# Altium schematic sheet HDMI.SchDoc
size A4
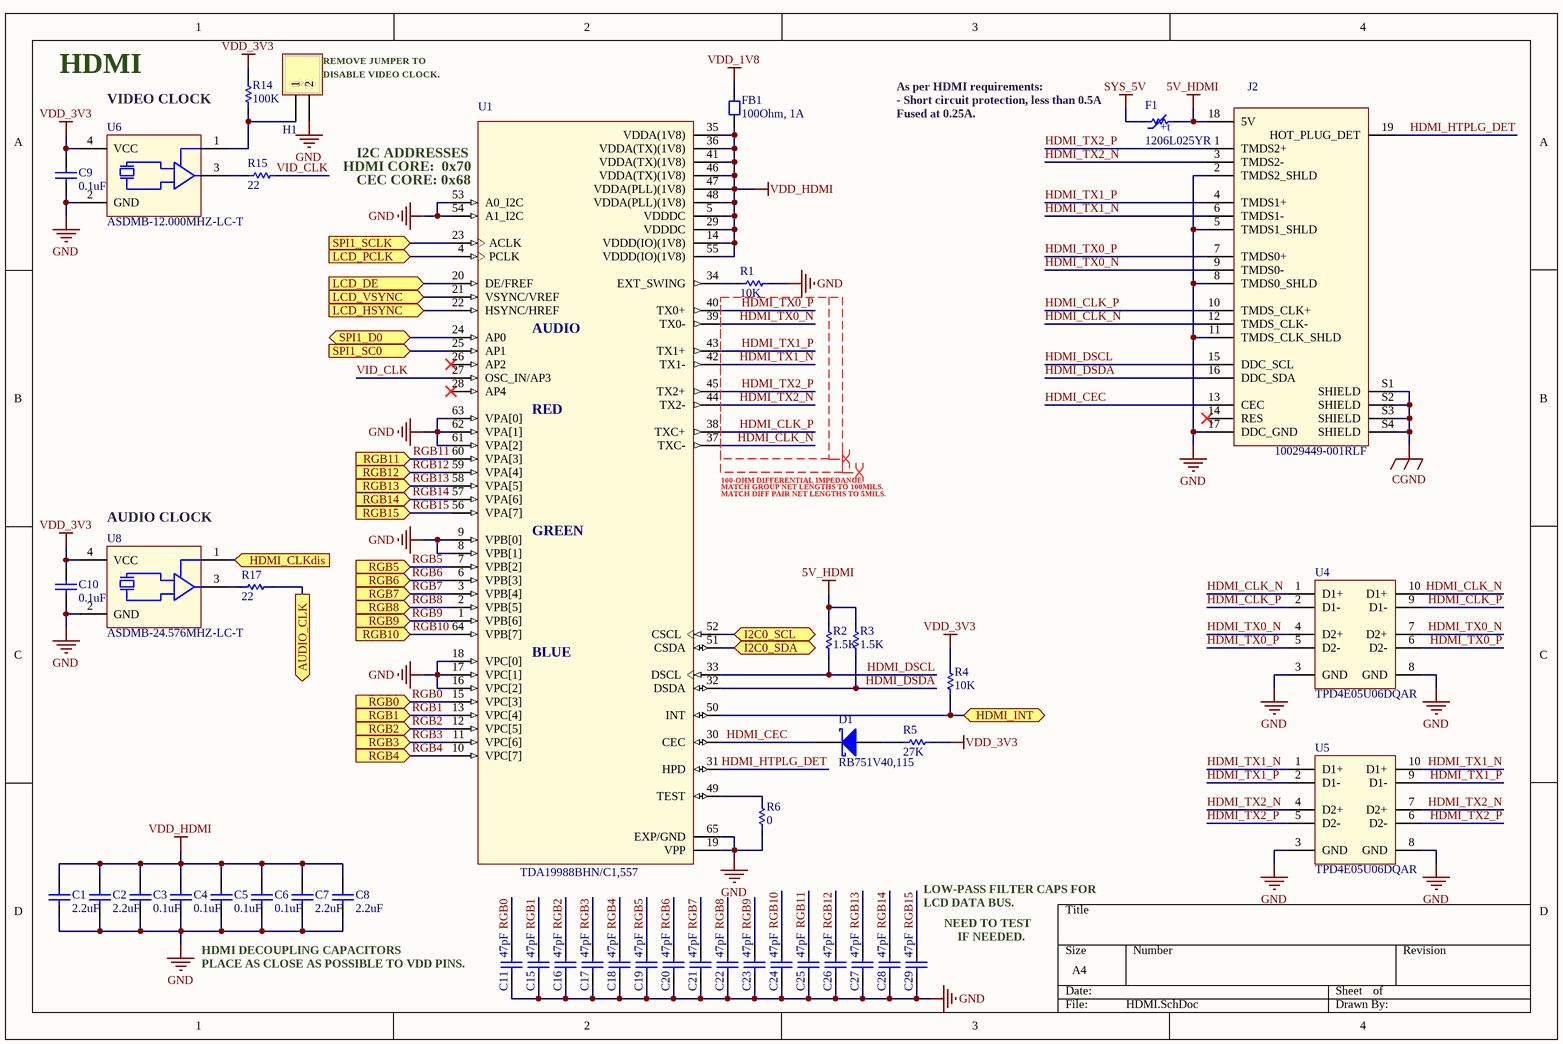
[diagram p0: HDMI.SchDoc]

## Parts
C1  2.2uF  [CAP_0603]
C2  2.2uF  [CAP_0603]
C3  0.1uF  [CAP_0603]
C4  0.1uF  [CAP_0603]
C5  0.1uF  [CAP_0603]
C6  0.1uF  [CAP_0603]
C7  2.2uF  [CAP_0603]
C8  2.2uF  [CAP_0603]
C9  0.1uF  [CAP_0603]
C10  0.1uF  [CAP_0603]
C11  47pF  [CAP_0402]
C15  47pF  [CAP_0402]
C16  47pF  [CAP_0402]
C17  47pF  [CAP_0402]
C18  47pF  [CAP_0402]
C19  47pF  [CAP_0402]
C20  47pF  [CAP_0402]
C21  47pF  [CAP_0402]
C22  47pF  [CAP_0402]
C23  47pF  [CAP_0402]
C24  47pF  [CAP_0402]
C25  47pF  [CAP_0402]
C26  47pF  [CAP_0402]
C27  47pF  [CAP_0402]
C28  47pF  [CAP_0402]
C29  47pF  [CAP_0402]
D1  RB751V40,115  [SOD-323]
F1  1206L025YR  [RES_1206]
FB1  100Ohm, 1A  [CAP_0603]
H1  02p  [HEADER_2X1_2.54MM]  (value not drawn)
J2  10029449-001RLF  [10029449-001RLF]
R1  10K  [RES_0603]
R2  1.5K  [RES_0603]
R3  1.5K  [RES_0603]
R4  10K  [RES_0603]
R5  27K  [RES_0603]
R6  0  [RES_0603]
R14  100K  [RES_0603]
R15  22  [RES_0603]
R17  22  [RES_0603]
U1  TDA19988BHN/C1,557  [HVQFN-64_9x9MM]
U4  TPD4E05U06DQAR  [USON-10_2.5X1MM]
U5  TPD4E05U06DQAR  [USON-10_2.5X1MM]
U6  ASDMB-12.000MHZ-LC-T  [ABRACON_4SMD_QFN]
U8  ASDMB-24.576MHZ-LC-T  [ABRACON_4SMD_QFN]

## Ports
AUDIO_CLK (out), HDMI_CLKdis (in), HDMI_INT (bidir), I2C0_SCL (bidir), I2C0_SDA (bidir), LCD_DE (in), LCD_HSYNC (in), LCD_PCLK (in), LCD_VSYNC (in), RGB0 (in), RGB1 (in), RGB2 (in), RGB3 (in), RGB4 (in), RGB5 (in), RGB6 (in), RGB7 (in), RGB8 (in), RGB9 (in), RGB10 (in), RGB11 (in), RGB12 (in), RGB13 (in), RGB14 (in), RGB15 (in), SPI1_D0 (bidir), SPI1_SC0 (in), SPI1_SCLK (in)

## Nets
5V_HDMI: F1.2 J2.18(5V) R2.2 R3.2
CGND: J2.S1(SHIELD) J2.S2(SHIELD) J2.S3(SHIELD) J2.S4(SHIELD)
GND: C1.1 C2.1 C3.1 C4.1 C5.1 C6.1 C7.1 C8.1 C9.1 C10.1 C11.1(N) C15.1(N) C16.1(N) C17.1(N) C18.1(N) C19.1(N) C20.1(N) C21.1(N) C22.1(N) C23.1(N) C24.1(N) C25.1(N) C26.1(N) C27.1(N) C28.1(N) C29.1(N) H1.2 J2.2(TMDS2_SHLD) J2.5(TMDS1_SHLD) J2.8(TMDS0_SHLD) J2.11(TMDS_CLK_SHLD) J2.17(DDC_GND) R1.1 R6.1 U1.8(VPB[1]) U1.9(VPB[0]) U1.16(VPC[2]) U1.17(VPC[1]) U1.18(VPC[0]) U1.19(VPP) U1.53(A0_I2C) U1.54(A1_I2C) U1.61(VPA[2]) U1.62(VPA[1]) U1.63(VPA[0]) U1.65(EXP/GND) U4.3(GND) U4.8(GND) U5.3(GND) U5.8(GND) U6.2(GND) U8.2(GND)
SYS_5V: F1.1
VDD_1V8: FB1.2
VDD_3V3: C9.2 C10.2 R4.2 R5.2 R14.2 U6.4(VCC) U8.4(VCC)
VDD_HDMI: C1.2 C2.2 C3.2 C4.2 C5.2 C6.2 C7.2 C8.2 FB1.1 U1.5(VDDDC) U1.14(VDDD(IO)(1V8)) U1.29(VDDDC) U1.35(VDDA(1V8)) U1.36(VDDA(TX)(1V8)) U1.41(VDDA(TX)(1V8)) U1.46(VDDA(TX)(1V8)) U1.47(VDDA(PLL)(1V8)) U1.48(VDDA(PLL)(1V8)) U1.55(VDDD(IO)(1V8))
AUDIO_CLK: R17.2 ; port AUDIO_CLK
HDMI_CEC: D1.2(K) J2.13(CEC) U1.30(CEC)
HDMI_CLK_N: J2.12(TMDS_CLK-) U1.37(TXC-) U4.1(D1+) U4.10(D1+)
HDMI_CLK_P: J2.10(TMDS_CLK+) U1.38(TXC+) U4.2(D1-) U4.9(D1-)
HDMI_CLKdis: U8.1(STDBY) ; port HDMI_CLKdis
HDMI_DSCL: J2.15(DDC_SCL) R2.1 U1.33(DSCL)
HDMI_DSDA: J2.16(DDC_SDA) R3.1 U1.32(DSDA)
HDMI_HTPLG_DET: J2.19(HOT_PLUG_DET) U1.31(HPD)
HDMI_INT: R4.1 U1.50(INT) ; port HDMI_INT
HDMI_TX0_N: J2.9(TMDS0-) U1.39(TX0-) U4.4(D2+) U4.7(D2+)
HDMI_TX0_P: J2.7(TMDS0+) U1.40(TX0+) U4.5(D2-) U4.6(D2-)
HDMI_TX1_N: J2.6(TMDS1-) U1.42(TX1-) U5.1(D1+) U5.10(D1+)
HDMI_TX1_P: J2.4(TMDS1+) U1.43(TX1+) U5.2(D1-) U5.9(D1-)
HDMI_TX2_N: J2.3(TMDS2-) U1.44(TX2-) U5.4(D2+) U5.7(D2+)
HDMI_TX2_P: J2.1(TMDS2+) U1.45(TX2+) U5.5(D2-) U5.6(D2-)
I2C0_SCL: U1.52(CSCL) ; port I2C0_SCL
I2C0_SDA: U1.51(CSDA) ; port I2C0_SDA
LCD_DE: U1.20(DE/FREF) ; port LCD_DE
LCD_HSYNC: U1.22(HSYNC/HREF) ; port LCD_HSYNC
LCD_PCLK: U1.4(PCLK) ; port LCD_PCLK
LCD_VSYNC: U1.21(VSYNC/VREF) ; port LCD_VSYNC
RGB0: C11.2(P) U1.15(VPC[3]) ; port RGB0
RGB1: C15.2(P) U1.13(VPC[4]) ; port RGB1
RGB2: C16.2(P) U1.12(VPC[5]) ; port RGB2
RGB3: C17.2(P) U1.11(VPC[6]) ; port RGB3
RGB4: C18.2(P) U1.10(VPC[7]) ; port RGB4
RGB5: C19.2(P) U1.7(VPB[2]) ; port RGB5
RGB6: C20.2(P) U1.6(VPB[3]) ; port RGB6
RGB7: C21.2(P) U1.3(VPB[4]) ; port RGB7
RGB8: C22.2(P) U1.2(VPB[5]) ; port RGB8
RGB9: C23.2(P) U1.1(VPB[6]) ; port RGB9
RGB10: C24.2(P) U1.64(VPB[7]) ; port RGB10
RGB11: C25.2(P) U1.60(VPA[3]) ; port RGB11
RGB12: C26.2(P) U1.59(VPA[4]) ; port RGB12
RGB13: C27.2(P) U1.58(VPA[5]) ; port RGB13
RGB14: C28.2(P) U1.57(VPA[6]) ; port RGB14
RGB15: C29.2(P) U1.56(VPA[7]) ; port RGB15
SPI1_D0: U1.24(AP0) ; port SPI1_D0
SPI1_SC0: U1.25(AP1) ; port SPI1_SC0
SPI1_SCLK: U1.23(ACLK) ; port SPI1_SCLK
VID_CLK: R15.2 U1.27(OSC_IN/AP3)
NetD1_1: D1.1(A) R5.1
NetH1_1: H1.1 R14.1 U6.1(STDBY)
NetR1_2: R1.2 U1.34(EXT_SWING)
NetR6_2: R6.2 U1.49(TEST)
NetR15_1: R15.1 U6.3(OUT)
NetR17_1: R17.1 U8.3(OUT)

Not connected (* = marked no-connect by the designer): J2 14(RES)*; U1 26(AP2)* 28(AP4)*

## Layout directives
differential pair; differential pair class TMDS; rule Matched Net Lengths [Tolerance = 5mil]: HDMI_CLK_N, HDMI_CLK_P, HDMI_TX0_N, HDMI_TX0_P, HDMI_TX1_N, HDMI_TX1_P, HDMI_TX2_N, HDMI_TX2_P
differential pair; differential pair class Z100_DIFF; rule Matched Net Lengths [Tolerance = 100mil]: HDMI_CLK_N, HDMI_CLK_P, HDMI_TX0_N, HDMI_TX0_P, HDMI_TX1_N, HDMI_TX1_P, HDMI_TX2_N, HDMI_TX2_P

## Notes on the sheet
- HDMI
- VIDEO CLOCK
- (near H1) REMOVE JUMPER TO
- (near H1) DISABLE VIDEO CLOCK.
- As per HDMI requirements:
- (near F1) - Short circuit protection, less than 0.5A
- Fused at 0.25A.
- (near U1) HDMI CORE:  0x70
- (near U1) I2C ADDRESSES
- (near U1) CEC CORE: 0x68
- (near U1) AUDIO
- (near U1) RED
- (near U8) AUDIO CLOCK
- (near U1) 100-OHM DIFFERENTIAL IMPEDANCE
- (near U1) MATCH GROUP NET LENGTHS TO 100MILS.
- (near U1) MATCH DIFF PAIR NET LENGTHS TO 5MILS.
- (near U1) GREEN
- (near U1) BLUE
- LOW-PASS FILTER CAPS FOR
- LCD DATA BUS.
- NEED TO TEST
- HDMI DECOUPLING CAPACITORS
- PLACE AS CLOSE AS POSSIBLE TO VDD PINS.
- (near C29) IF NEEDED.
- (in symbol 1206L025YR) +t

## Library data of the parts
C1 C2 C7 C8 = C0603C225M4PAC7867: CAP CER 2.2UF 16V X5R 0603; Manufacturer: KEMET; Manufacturer Part No.: C0603C104M4RACTU; Tolerance: 20%; ComponentLink1Description: Manufacturer; ComponentLink1URL: http://www.we-online.de; Value: 2.2uF; Rated Voltage: 16V; Ceramic Type: X5R; Supplier Part No.: 399-13136-1-ND; Package Reference: CAP_0603; Package Description: 0603; Mounting Technology: SMD; Datasheet: https://content.kemet.com/datasheets/KEM_C1002_X7R_SMD.pdf; Supplier: Digi-Key; ComponentLink2Description: Datasheet; ComponentLink2URL: https://content.kemet.com/datasheets/KEM_C1002_X7R_SMD.pdf
C3-C6 C9 C10 = C0603C104M4RACTU: CAP CER 0.1UF 16V X7R 0603; Manufacturer: KEMET; Tolerance: 20%; ComponentLink1Description: Manufacturer; ComponentLink1URL: http://www.we-online.de; Value: 0.1uF; Rated Voltage: 16V; Ceramic Type: X7R; Supplier Part No.: 399-1099-1-ND; Package Reference: CAP_0603; Package Description: 0603; Mounting Technology: SMD; Manufacturer Part No.: C0603C104M4RACTU; Datasheet: https://content.kemet.com/datasheets/KEM_C1002_X7R_SMD.pdf; Supplier: Digi-Key; ComponentLink2Description: Datasheet; ComponentLink2URL: https://content.kemet.com/datasheets/KEM_C1002_X7R_SMD.pdf
C11 C15-C29 = 885012005011: CAP CER 47PF 10V C0G/NP0 0402; Manufacturer: Wurth Elektronik; Tolerance: 5%; Rated Voltage: 10 VDC; ComponentLink1Description: Manufacturer; ComponentLink1URL: http://www.we-online.de; ComponentLink2Description: Datasheet; ComponentLink2URL: https://katalog.we-online.com/pbs/datasheet/865080345012.pdf; Mounting Technology: SMD; Value: 47 pF; Manufacturer Part No.: 885012005011; Datasheet: https://katalog.we-online.de/pbs/datasheet/885012005011.pdf; Supplier: Digi-Key; Package Reference: CAP_0402; Supplier Part No.: 732-7429-1-ND; Package Description: 0402
D1 = RB751V40,115: DIODE SCHOTTKY 40V 120MA SOD323; Manufacturer: Nexperia USA Inc.; Forward Voltage: 0.37V; Mounting Technology: SMD; Supplier Part No.: 1727-6301-1-ND; Manufacturer Part No.: RB751V40,115; Package Reference: *; Package Description: *; Forward Current: 120mA; Supplier: Digi-Key
F1 = 1206L025YR: PTC RESET FUSE 16V 250MA 1206; Manufacturer: Littelfuse Inc.; Rated Current: 0.25A; Manufacturer Part No.: 1206L025YR; Supplier: Digi-Key; Mounting Technology: SMD; Supplier Part No.: F2110CT-ND; Package Description: Polymeric PTC Resettable Fuse 16V 250mA Ih Surface Mount 1206 (3216 Metric), Concave; Package Reference: CAP_1206; Datasheet: https://www.littelfuse.com/~/media/electronics/datasheets/resettable_ptcs/littelfuse_ptc_1206l_datasheet.pdf.pdf
FB1 = MPZ1608D101BTA00: FERRITE BEAD 100 OHM 0603 1LN; Manufacturer: TDK Corporation; Datasheet: https://product.tdk.com/info/en/catalog/datasheets/beads_commercial_power_mpz1608_en.pdf; Manufacturer Part No.: MPZ1608D101BTA00; Supplier: Digi-Key; Package Description: 100 Ohms @ 100MHz 1 Power Line Ferrite Bead 0603 (1608 Metric) 1A 150mOhm; Supplier Part No.: 445-2988-1-ND; Package Reference: CAP_0603; Mounting Technology: SMD
H1 = 61300211121: CONN HEADER VERT 2POS 2.54MM; Manufacturer: Wurth Elektronik; ComponentLink1Description: Manufacturer; ComponentLink1URL: http://www.we-online.de; ComponentLink2Description: Datasheet; ComponentLink2URL: http://katalog.we-online.de/em/datasheet/6130xx11121.pdf; Supplier Part No.: 732-5315-ND; Supplier: Digi-Key; Package Reference: HEADER_2X1_2.54MM; Package Description: Header 2-pin 2.54mm 100mils; Mounting Technology: THRU; Manufacturer Part No.: 61300211121; Datasheet: https://www.we-online.de/katalog/datasheet/6130xx11121.pdf
J2 = 10029449-001RLF: CONN RCPT 1.4 HDMI 19POS SMD R/A; Manufacturer: Amphenol ICC (FCI); Supplier: Digi-Key; Manufacturer Part No.: 10029449-001RLF; Supplier Part No.: 609-1010-1-ND; Mounting Technology: THRU; Package Reference: 10029449-001RLF; Package Description: HDMI HDMI™ 1.4 Receptacle Connector 19 Position Surface Mount, Right Angle; Through Hole; Datasheet: https://cdn.amphenol-icc.com/media/wysiwyg/files/documentation/datasheet/inputoutput/io_hdmi_receptacles.pdf
R1 R4 = RC0603FR-0710KL: RES SMD 10K OHM 1% 1/10W 0603; Manufacturer: Yageo; Tolerance: 1%; Manufacturer Part No.: RC0603FR-0710KL; Date: 2020; ComponentLink1Description: Manufacturer Link; ComponentLink1URL: http://www.vishay.com/company/brands/dale/; ComponentLink2Description: Datasheet; ComponentLink2URL: http://www.vishay.com/docs/20035/dcrcwe3.pdf; Supplier: Digikey; Supplier Part No.: 311-10.0KHRCT-ND; Datasheet: https://www.yageo.com/upload/media/product/productsearch/datasheet/rchip/PYu-RC_Group_51_RoHS_L_10.pdf; Package Reference: RES_0603; Package Description: 0603; Mounting Technology: SMD; Value: 10K; Power Rating: 1/10W
R2 R3 = RC0603FR-071K5L: RES SMD 1.5K OHM 1% 1/10W 0603; Manufacturer: Yageo; Tolerance: 1%; Manufacturer Part No.: RC0603FR-071K5L; Date: 2020; ComponentLink1Description: Manufacturer Link; ComponentLink1URL: http://www.vishay.com/company/brands/dale/; ComponentLink2Description: Datasheet; ComponentLink2URL: http://www.vishay.com/docs/20035/dcrcwe3.pdf; Supplier: Digikey; Supplier Part No.: 311-1.50KHRCT-ND; Datasheet: https://www.yageo.com/upload/media/product/productsearch/datasheet/rchip/PYu-RC_Group_51_RoHS_L_10.pdf; Package Reference: RES_0603; Package Description: 0603; Mounting Technology: SMD; Value: 1.5K; Power Rating: 1/10W
R5 = RC0603FR-0727KL: RES SMD 27K OHM 1% 1/10W 0603; Manufacturer: Yageo; Tolerance: 1%; Manufacturer Part No.: RC0603FR-0727KL; Date: 2020; ComponentLink1Description: Manufacturer Link; ComponentLink1URL: http://www.vishay.com/company/brands/dale/; ComponentLink2Description: Datasheet; ComponentLink2URL: http://www.vishay.com/docs/20035/dcrcwe3.pdf; Supplier: Digikey; Supplier Part No.: 311-27.0KHRCT-ND; Datasheet: https://www.yageo.com/upload/media/product/productsearch/datasheet/rchip/PYu-RC_Group_51_RoHS_L_10.pdf; Package Reference: RES_0603; Package Description: 0603; Mounting Technology: SMD; Value: 27K; Power Rating: 1/10W
R6 = RC0603JR-070RL: RES SMD 0 OHM JUMPER 1/10W 0603; Manufacturer: Yageo; Manufacturer Part No.: RC0603JR-070RL; Date: 2020; ComponentLink1Description: Manufacturer Link; ComponentLink1URL: http://www.vishay.com/company/brands/dale/; ComponentLink2Description: Datasheet; ComponentLink2URL: http://www.vishay.com/docs/20035/dcrcwe3.pdf; Supplier: Digikey; Supplier Part No.: 311-0.0GRCT-ND; Datasheet: https://www.yageo.com/upload/media/product/productsearch/datasheet/rchip/PYu-RC_Group_51_RoHS_L_10.pdf; Package Reference: RES_0603; Package Description: 0603; Mounting Technology: SMD; Value: 0; Power Rating: 1/10W
R14 = RC0603FR-07100KL: RES SMD 100K OHM 1% 1/10W 0603; Manufacturer: Yageo; Tolerance: 1%; Manufacturer Part No.: RC0603FR-07100KL; Date: 2020; ComponentLink1Description: Manufacturer Link; ComponentLink1URL: http://www.vishay.com/company/brands/dale/; ComponentLink2Description: Datasheet; ComponentLink2URL: http://www.vishay.com/docs/20035/dcrcwe3.pdf; Supplier: Digikey; Supplier Part No.: 311-100KHRCT-ND; Datasheet: https://www.yageo.com/upload/media/product/productsearch/datasheet/rchip/PYu-RC_Group_51_RoHS_L_10.pdf; Package Reference: RES_0603; Package Description: 0603; Mounting Technology: SMD; Value: 100K; Power Rating: 1/10W
R15 R17 = RC0603JR-0722RL: RES SMD 22 OHM 5% 1/10W 0603; Manufacturer: Yageo; Tolerance: 5%; Manufacturer Part No.: RC0603JR-0722RL; Date: 2020; ComponentLink1Description: Manufacturer Link; ComponentLink1URL: http://www.vishay.com/company/brands/dale/; ComponentLink2Description: Datasheet; ComponentLink2URL: http://www.vishay.com/docs/20035/dcrcwe3.pdf; Supplier: Digikey; Supplier Part No.: 311-22GRCT-ND; Datasheet: https://www.yageo.com/upload/media/product/productsearch/datasheet/rchip/PYu-RC_Group_51_RoHS_L_10.pdf; Package Reference: RES_0603; Package Description: 0603; Mounting Technology: SMD; Power Rating: 1/10W; Value: 22
U1 = TDA19988BHN: IC VIDEO HDMI TRANS 64HVQFN; Manufacturer: NXP USA Inc.; Manufacturer Part No.: TDA19988BHN/C1,557; Supplier: Digi-Key; Package Reference: HVQFN-64_9x9MM; Supplier Part No.: 568-12059-ND; Package Description: Video  IC   64-HVQFN (9x9) Package; Mounting Technology: SMD; ComponentLink1Description: Datasheet; ComponentLink1URL: https://media.digikey.com/pdf/Data%20Sheets/NXP%20PDFs/TDA19988_DS_21_july_2011.pdf
U4 U5 = TPD4E05U06DQAR: TVS DIODE 5.5V 14V 10SON; Manufacturer: Texas Instruments; Supplier: Digi-Key; Manufacturer Part No.: TPD4E05U06DQAR; Supplier Part No.: 296-35765-1-ND; Package Reference: USON-10; Package Description: 14V Clamp 2.5A (8/20µs) Ipp Tvs Diode Surface Mount 10-USON (2.5x1); Mounting Technology: SMD; Datasheet: https://www.ti.com/lit/ds/symlink/tpd4e05u06.pdf
U6 = ASDMB-12.000MHZ-LC-T: MEMS OSC XO 12.0000MHZ LVCMOS; Manufacturer: Abracon LLC; Supplier: Digi-Key; Manufacturer Part No.: ASDMB-12.000MHZ-LC-T; Supplier Part No.: 535-11724-1-ND; Mounting Technology: SMD; Package Reference: ABRACON_4SMD_QFN; Package Description: QFN-4, ABRACON 4-SMD; Datasheet: https://abracon.com/Oscillators/ASDMB.pdf
U8 = ASDMB-24.576MHZ-LC-T: MEMS OSC XO 24.5760MHZ LVCMOS; Manufacturer: Abracon LLC; Supplier: Digi-Key; Manufacturer Part No.: ASDMB-24.576MHZ-LC-T; Supplier Part No.: 535-11729-1-ND; Mounting Technology: SMD; Package Reference: ABRACON_4SMD_QFN; Package Description: QFN-4, ABRACON 4-SMD; Datasheet: https://abracon.com/Oscillators/ASDMB.pdf